# EAGLE board Full (EAGLE 9.6.2), part 1 of 3
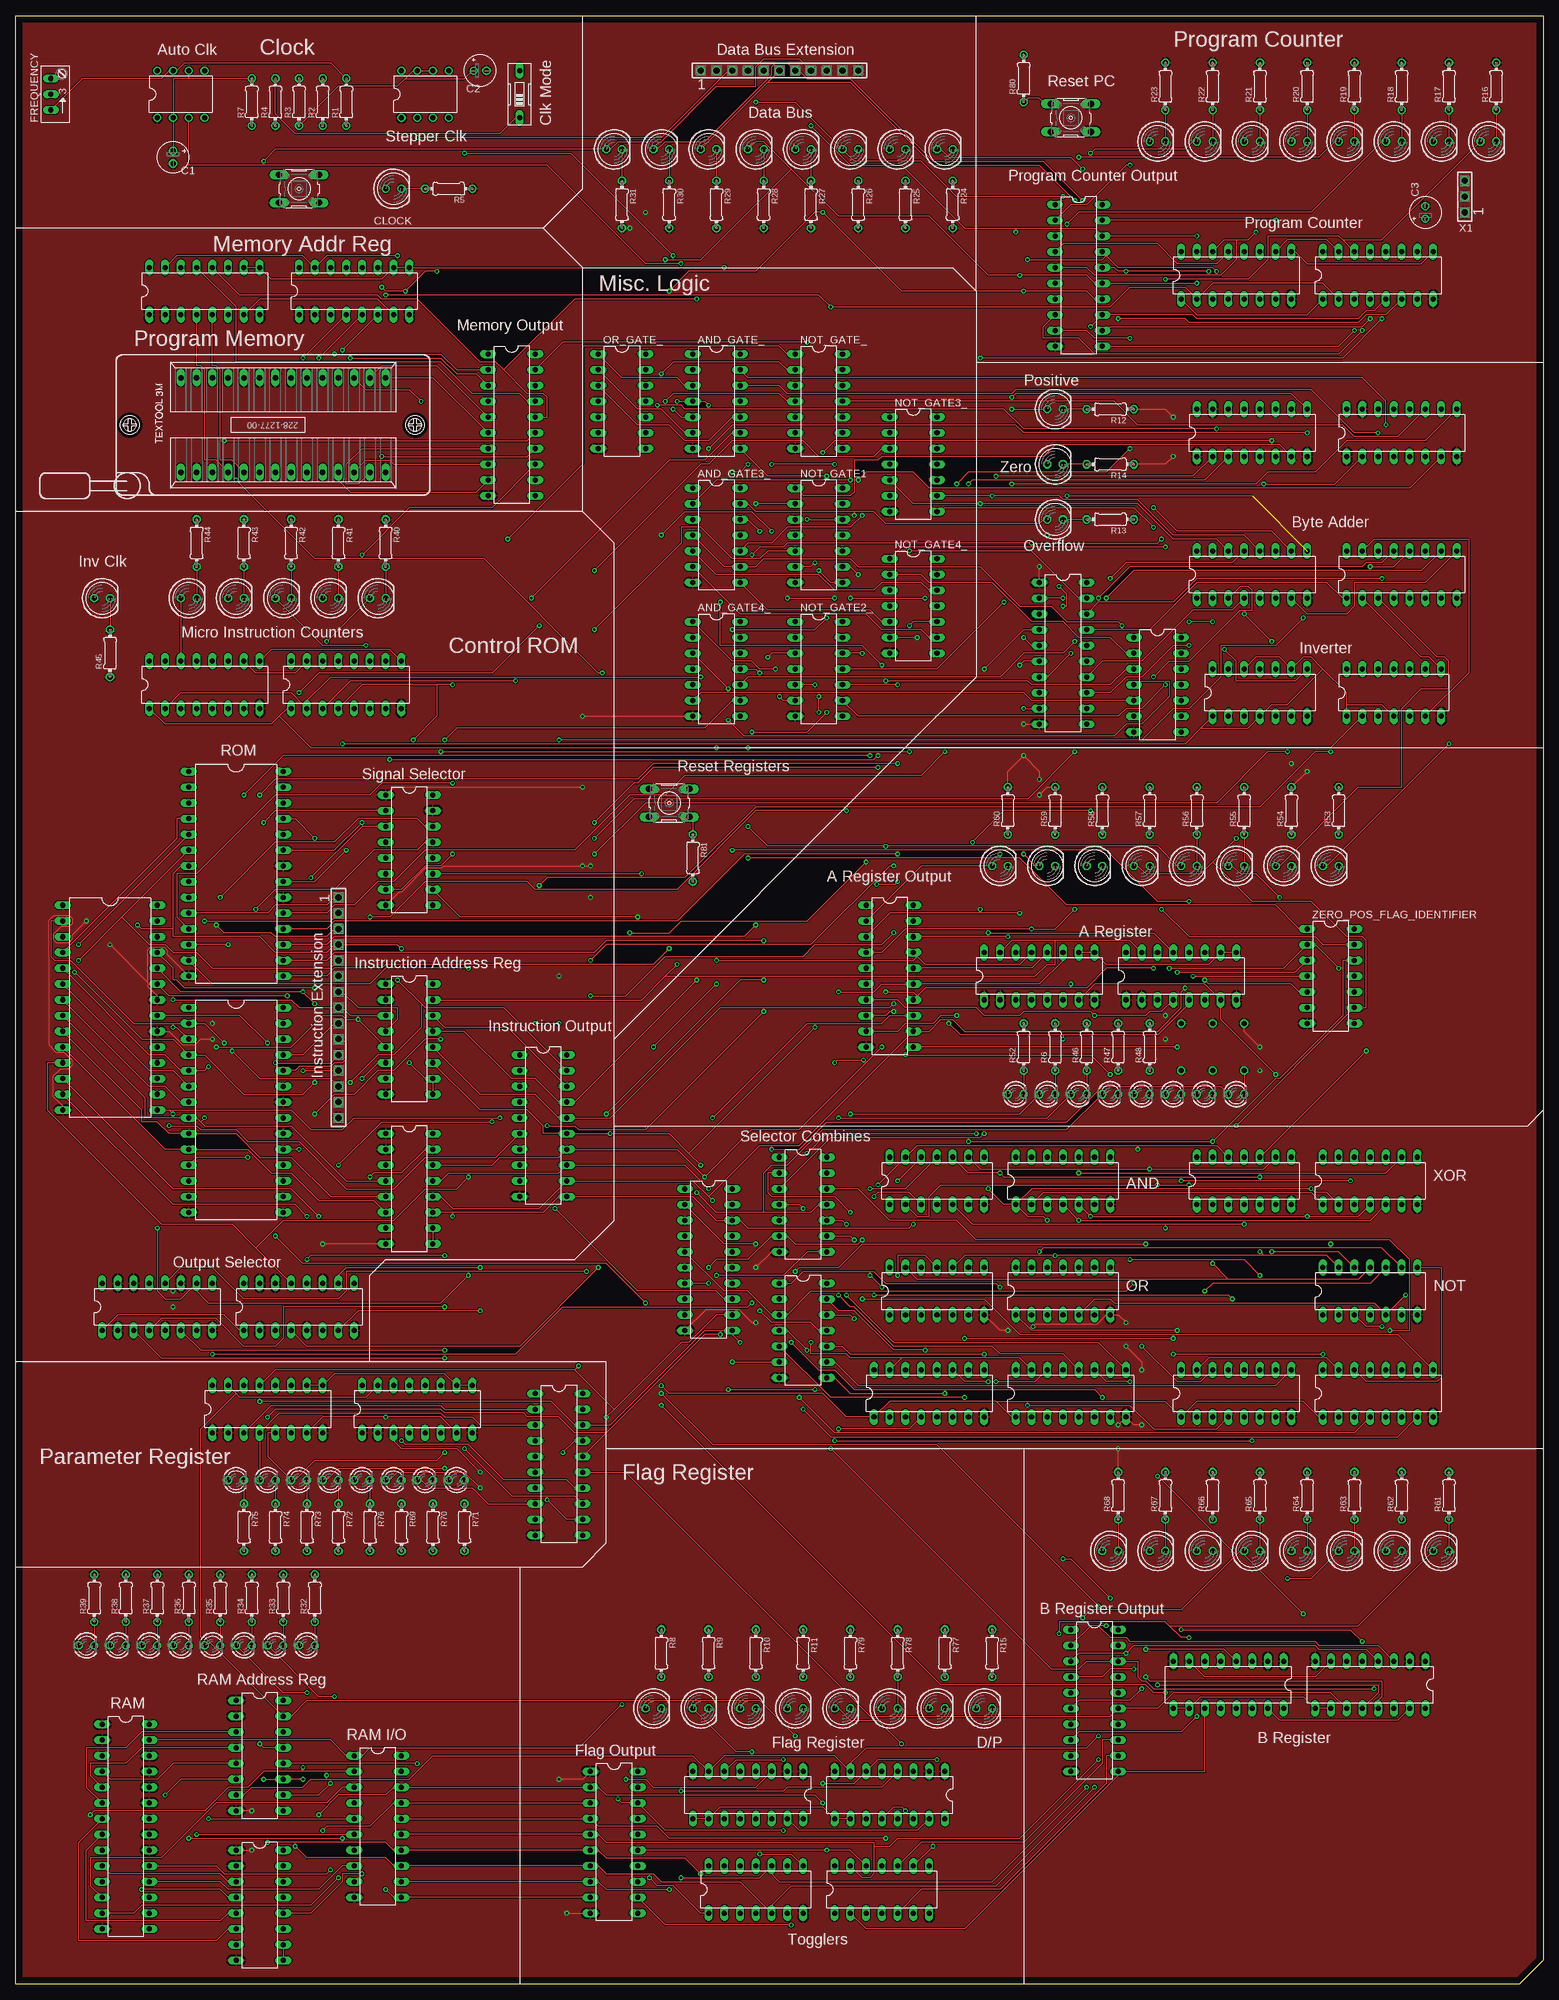
[diagram p5: board, top side]
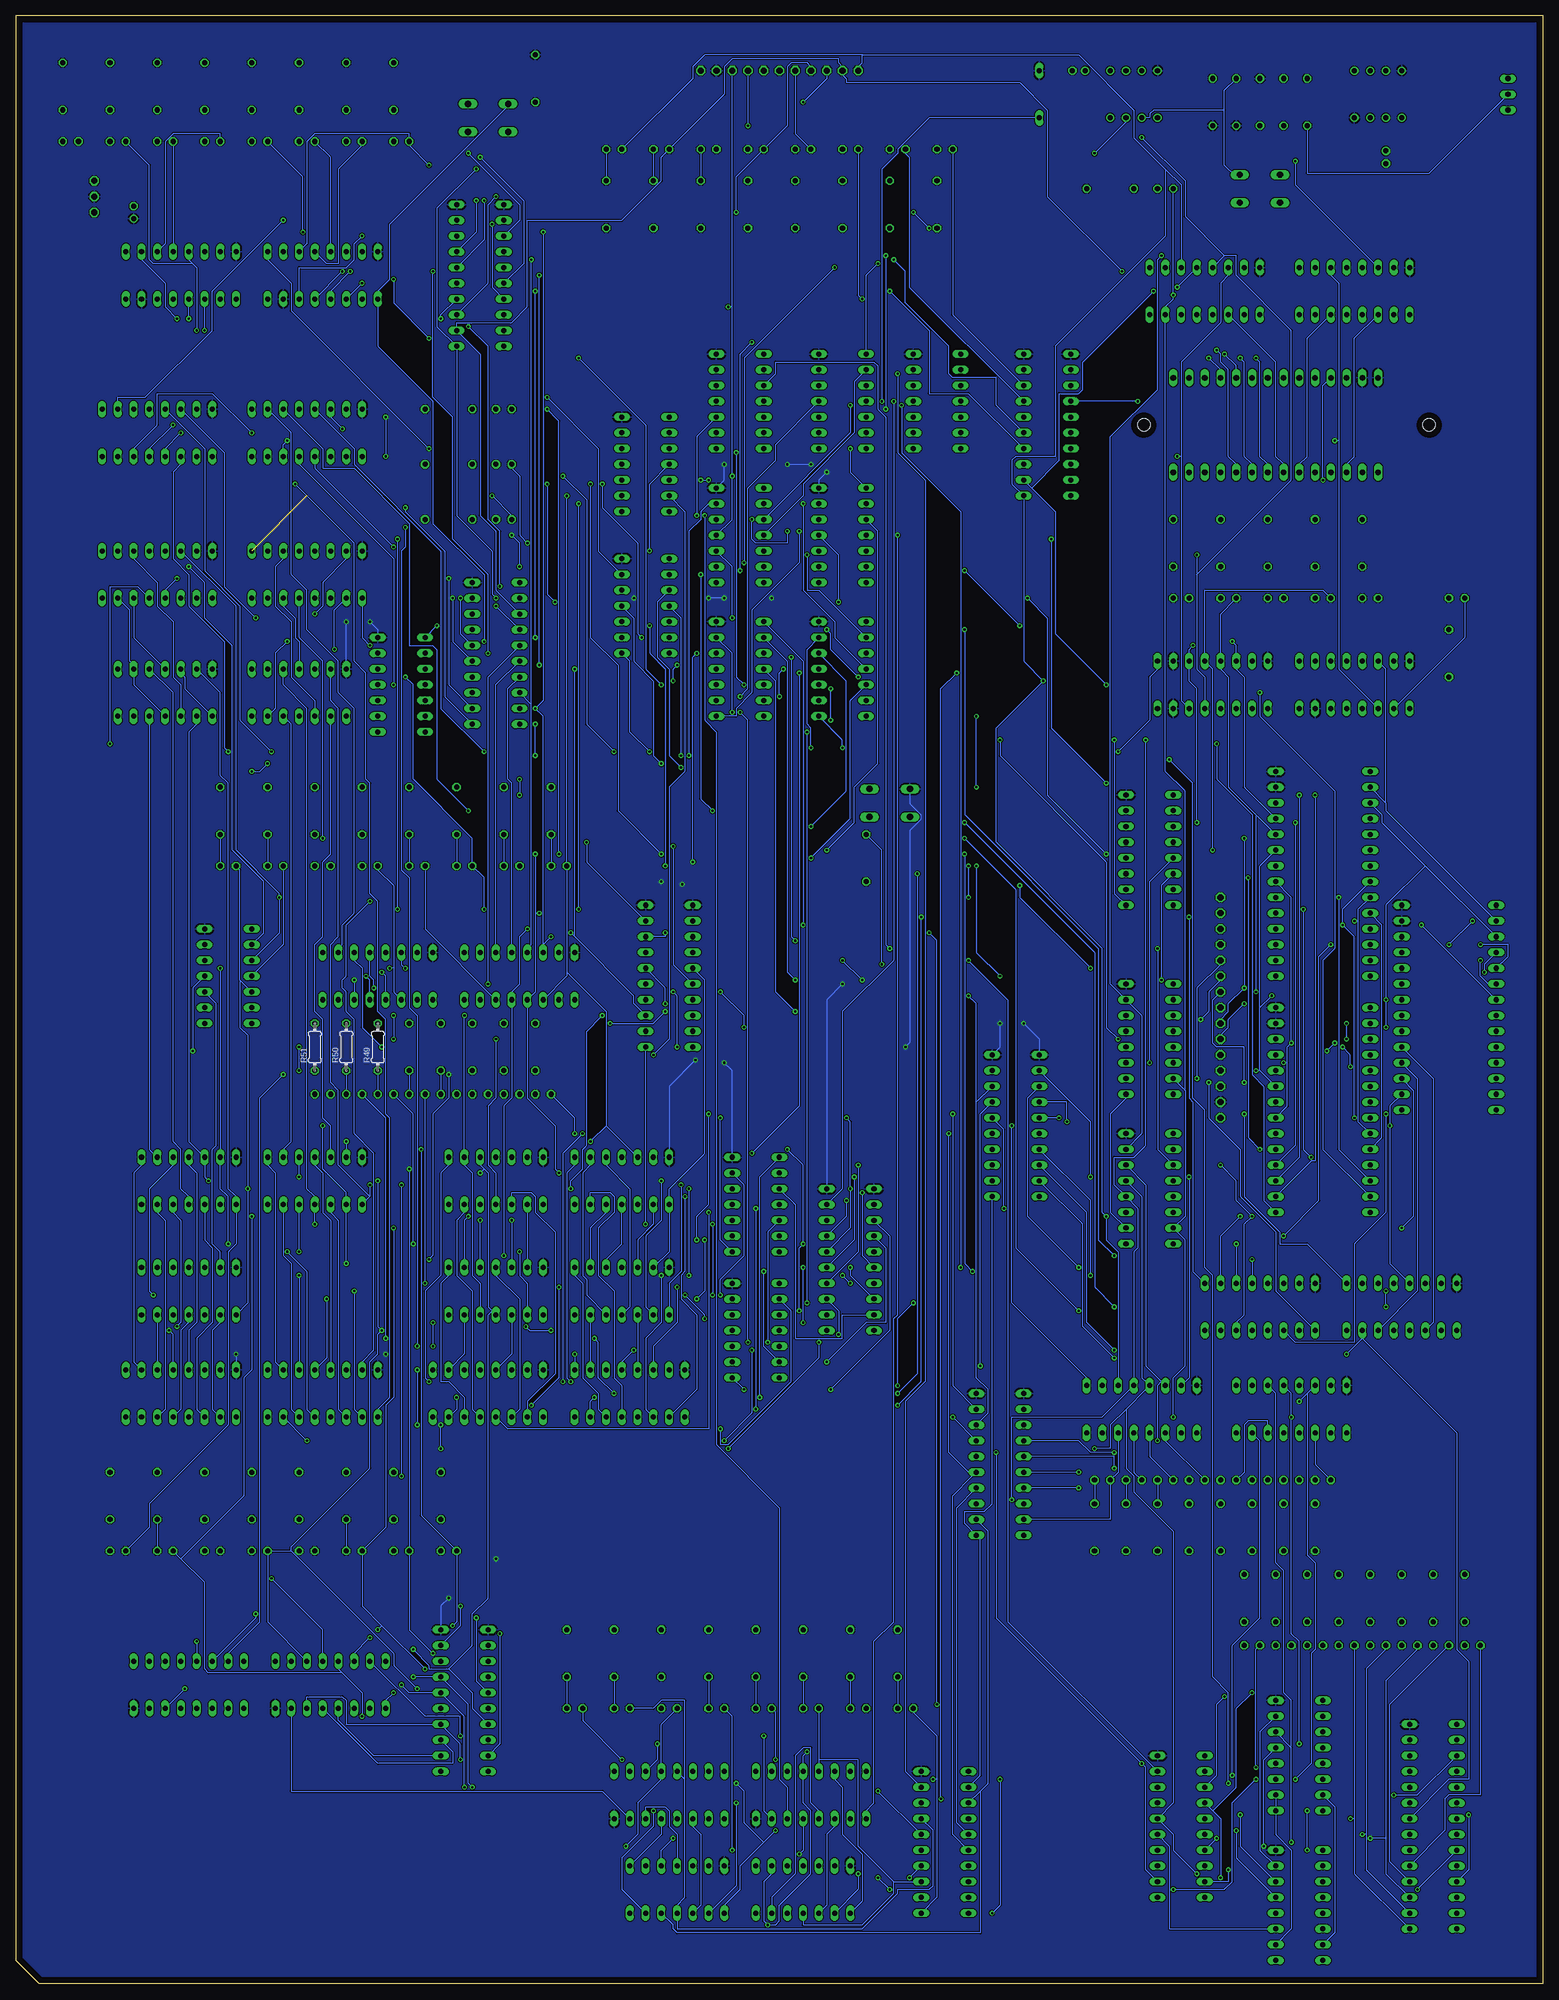
[diagram p6: board, bottom side, seen from below]

Size 246.38 x 317.5 mm. Coordinates in mm from the lower left corner, seen from the top.
Outline: 0,0 0,317.5 246.38,317.5 246.38,3.81 242.57,0 0,0
Copper layers (1*16): Top 0.035mm / dielectric 1.5mm / Bottom 0.035mm
Design rules "default": minimum track width 6mil, minimum drill 0.35mm, track to track 6mil, track to pad 6mil, pad to pad 6mil, via to via 6mil, smd to smd 6mil, copper to edge 40mil, drill to drill 6mil, minimum pad ring 10mil, minimum via ring 8mil, stop-mask expansion 4mil, vias tented up to drill 0mil, thermal gap 10mil

## Footprints (pad centres in the part's own frame; a part is rotated, then mirrored left to right if it is on the bottom)
DIL14 = drill 0.813 long: 1 -7.62,-3.81; 2 -5.08,-3.81; 3 -2.54,-3.81; 4 0,-3.81; 5 2.54,-3.81; 6 5.08,-3.81; 7 7.62,-3.81; 8 7.62,3.81; 9 5.08,3.81; 10 2.54,3.81; 11 0,3.81; 12 -2.54,3.81; 13 -5.08,3.81; 14 -7.62,3.81
DIL16 = drill 0.813 long: 1 -8.89,-3.81; 2 -6.35,-3.81; 3 -3.81,-3.81; 4 -1.27,-3.81; 5 1.27,-3.81; 6 3.81,-3.81; 7 6.35,-3.81; 8 8.89,-3.81; 9 8.89,3.81; 10 6.35,3.81; 11 3.81,3.81; 12 1.27,3.81; 13 -1.27,3.81; 14 -3.81,3.81; 15 -6.35,3.81; 16 -8.89,3.81
DIL08 = drill 0.813 pad 1.27: 1 -3.81,-3.81; 2 -1.27,-3.81; 3 1.27,-3.81; 4 3.81,-3.81; 5 3.81,3.81; 6 1.27,3.81; 7 -1.27,3.81; 8 -3.81,3.81
E2-5 = drill 0.813 pad 1.27: + -1.016,0 | drill 0.813 pad 1.27 octagon: - 1.016,0
EDG-01 = drill 0.813 long: 1 0,-3.81; 2 0,3.81
B3F-10XX = drill 1.016 long: 1 -3.251,2.261; 2 3.251,2.261; 3 -3.251,-2.261; 4 3.251,-2.261
LED5MM = drill 0.813 octagon: A -1.27,0; K 1.27,0
SSW-111-02-G-S = drill 1 pad 1.5 octagon: 1 -12.7,0; 2 -10.16,0; 3 -7.62,0; 4 -5.08,0; 5 -2.54,0; 6 0,0; 7 2.54,0; 8 5.08,0; 9 7.62,0; 10 10.16,0; 11 12.7,0
RJ9W = drill 0.813 long: A 2.54,0.635; E -2.54,0.635; S 0,0.635
DIL28-6 = drill 0.813 long: 1 -16.51,-7.62; 2 -13.97,-7.62; 3 -11.43,-7.62; 4 -8.89,-7.62; 5 -6.35,-7.62; 6 -3.81,-7.62; 7 -1.27,-7.62; 8 1.27,-7.62; 9 3.81,-7.62; 10 6.35,-7.62; 11 8.89,-7.62; 12 11.43,-7.62; 13 13.97,-7.62; 14 16.51,-7.62; 15 16.51,7.62; 16 13.97,7.62; 17 11.43,7.62; 18 8.89,7.62; 19 6.35,7.62; 20 3.81,7.62; 21 1.27,7.62; 22 -1.27,7.62; 23 -3.81,7.62; 24 -6.35,7.62; 25 -8.89,7.62; 26 -11.43,7.62; 27 -13.97,7.62; 28 -16.51,7.62
SSW-115-02-G-S = drill 1 pad 1.5 octagon: 1 -17.78,0; 2 -15.24,0; 3 -12.7,0; 4 -10.16,0; 5 -7.62,0; 6 -5.08,0; 7 -2.54,0; 8 0,0; 9 2.54,0; 10 5.08,0; 11 7.62,0; 12 10.16,0; 13 12.7,0; 14 15.24,0; 15 17.78,0
LED3MM = drill 0.813 octagon: A -1.27,0; K 1.27,0
228-1277-00-0602J = drill 0.9 long: 1 -16.51,-7.62; 2 -13.97,-7.62; 3 -11.43,-7.62; 4 -8.89,-7.62; 5 -6.35,-7.62; 6 -3.81,-7.62; 7 -1.27,-7.62; 8 1.27,-7.62; 9 3.81,-7.62; 10 6.35,-7.62; 11 8.89,-7.62; 12 11.43,-7.62; 13 13.97,-7.62; 14 16.51,-7.62; 15 16.51,7.62; 16 13.97,7.62; 17 11.43,7.62; 18 8.89,7.62; 19 6.35,7.62; 20 3.81,7.62; 21 1.27,7.62; 22 -1.27,7.62; 23 -3.81,7.62; 24 -6.35,7.62; 25 -8.89,7.62; 26 -11.43,7.62; 27 -13.97,7.62; 28 -16.51,7.62 | hole 2: 21.24,0; -24.74,0
DIL20 = drill 0.813 long: 1 -11.43,-3.81; 2 -8.89,-3.81; 3 -6.35,-3.81; 4 -3.81,-3.81; 5 -1.27,-3.81; 6 1.27,-3.81; 7 3.81,-3.81; 8 6.35,-3.81; 9 8.89,-3.81; 10 11.43,-3.81; 11 11.43,3.81; 12 8.89,3.81; 13 6.35,3.81; 14 3.81,3.81; 15 1.27,3.81; 16 -1.27,3.81; 17 -3.81,3.81; 18 -6.35,3.81; 19 -8.89,3.81; 20 -11.43,3.81
0204/7 = drill 0.813 octagon: 1 -3.81,0; 2 3.81,0
DIL28-3 = drill 0.813 long: 1 -16.51,-3.81; 2 -13.97,-3.81; 3 -11.43,-3.81; 4 -8.89,-3.81; 5 -6.35,-3.81; 6 -3.81,-3.81; 7 -1.27,-3.81; 8 1.27,-3.81; 9 3.81,-3.81; 10 6.35,-3.81; 11 8.89,-3.81; 12 11.43,-3.81; 13 13.97,-3.81; 14 16.51,-3.81; 15 16.51,3.81; 16 13.97,3.81; 17 11.43,3.81; 18 8.89,3.81; 19 6.35,3.81; 20 3.81,3.81; 21 1.27,3.81; 22 -1.27,3.81; 23 -3.81,3.81; 24 -6.35,3.81; 25 -8.89,3.81; 26 -11.43,3.81; 27 -13.97,3.81; 28 -16.51,3.81
SSW-103-02-G-S = drill 1 pad 1.5 octagon: 1 -2.54,0; 2 0,0; 3 2.54,0

## Placement (x,y rotation side)
4_INP_OR_GATE  4072N  [DIL14]  184.15,209.55 270 top
ADDER_LOWER  74LS283N  [DIL16]  223.52,227.33 0 top
ADDER_UPPER  74LS283N  [DIL16]  199.39,227.33 0 top
ADDR_MEM_REG_LOWER  74LS173N  [DIL16]  54.61,273.05 0 top
ADDR_MEM_REG_UPPER  74LS173N  [DIL16]  30.48,273.05 0 top
ADDR_REG_A_LOWER  74LS173N  [DIL16]  187.96,162.56 0 top
ADDR_REG_A_UPPER  74LS173N  [DIL16]  165.1,162.56 0 top
ADDR_REG_CALC_LOWER  74LS173N  [DIL16]  195.58,48.26 180 top
ADDR_REG_CALC_UPPER  74LS173N  [DIL16]  218.44,48.26 180 top
ADDR_REG_PARAM_LOWER  74LS173N  [DIL16]  64.77,92.71 0 top
ADDR_REG_PARAM_UPPER  74LS173N  [DIL16]  40.64,92.71 0 top
AND_GATE1_  74LS08N  [DIL14]  168.91,129.54 0 top
AND_GATE2_  74LS08N  [DIL14]  148.59,129.54 0 top
AND_GATE3_  74LS08N  [DIL14]  113.03,233.68 270 top
AND_GATE4_  74LS08N  [DIL14]  113.03,212.09 270 top
AND_GATE_  74LS08N  [DIL14]  113.03,255.27 270 top
AUTO_CLOCK  NE555N  [DIL08]  26.67,304.8 0 top
BRANCH_SELECTOR  74HC139N  [DIL16]  199.39,250.19 0 top
C1  4.7uF  [E2-5]  25.4,294.64 270 top
C2  0.1uF  [E2-5]  74.93,308.61 0 top
C3  0.1uF  [E2-5]  227.33,285.75 90 top
CLK_MODE  [EDG-01]  81.28,304.8 0 top
CLK_TRIGGER  [B3F-10XX]  45.72,289.56 0 top
CLOCK  Yellow  [LED5MM]  60.96,289.56 0 top
DATABUS_1  LED  [LED5MM]  149.86,295.91 0 top
DATABUS_2  [LED5MM]  142.24,295.91 0 top
DATABUS_3  [LED5MM]  134.62,295.91 0 top
DATABUS_4  [LED5MM]  127,295.91 0 top
DATABUS_5  [LED5MM]  119.38,295.91 0 top
DATABUS_6  [LED5MM]  111.76,295.91 0 top
DATABUS_7  [LED5MM]  104.14,295.91 0 top
DATABUS_8  [LED5MM]  96.52,295.91 0 top
EXTENSION  SSW-111-02-G-S  [SSW-111-02-G-S]  123.19,308.61 0 top
FLAG_1  [LED5MM]  156.21,44.45 0 top
FLAG_2  [LED5MM]  148.59,44.45 0 top
FLAG_3  [LED5MM]  140.97,44.45 0 top
FLAG_4  [LED5MM]  133.35,44.45 0 top
FLAG_5  [LED5MM]  125.73,44.45 0 top
FLAG_6  [LED5MM]  118.11,44.45 0 top
FLAG_7  [LED5MM]  110.49,44.45 0 top
FLAG_8  [LED5MM]  102.87,44.45 0 top
FLAG_REG_LOWER  74LS173N  [DIL16]  118.11,30.48 180 top
FLAG_REG_UPPER  74LS173N  [DIL16]  140.97,30.48 180 top
FREQUENCY  100k  [RJ9W]  6.35,304.8 90 top
INSRUCTION_REGISTER_SELECTOR_LOWER  74LS157N  [DIL16]  45.72,109.22 0 top
INSRUCTION_REGISTER_SELECTOR_UPPER  74LS157N  [DIL16]  22.86,109.22 0 top
INSTRUC_REGISTER_LOWER  74LS173N  [DIL16]  63.5,128.27 270 top
INSTRUC_REGISTER_UPPER  74LS173N  [DIL16]  63.5,152.4 270 top
INSTRUCTION_MEMORY_0  AT28C64B  [DIL28-6]  15.24,157.48 270 top
INSTRUCTION_MEMORY_1  AT28C64B  [DIL28-6]  35.56,140.97 270 top
INSTRUCTION_MEMORY_2  AT28C64B  [DIL28-6]  35.56,179.07 270 top
INSTRUCTIONS_EXTENSION  SSW-115-02-G-S  [SSW-115-02-G-S]  52.07,157.48 270 top
INVERTED_CLK_LED  White  [LED5MM]  13.97,223.52 0 top
LED_A_REG_1  [LED5MM]  212.09,180.34 0 top
LED_A_REG_2  [LED5MM]  204.47,180.34 0 top
LED_A_REG_3  [LED5MM]  196.85,180.34 0 top
LED_A_REG_4  [LED5MM]  189.23,180.34 0 top
LED_A_REG_5  [LED5MM]  181.61,180.34 0 top
LED_A_REG_6  [LED5MM]  173.99,180.34 0 top
LED_A_REG_7  [LED5MM]  166.37,180.34 0 top
LED_A_REG_8  [LED5MM]  158.75,180.34 0 top
LED_B_REG_1  [LED5MM]  229.87,69.85 0 top
LED_B_REG_2  [LED5MM]  222.25,69.85 0 top
LED_B_REG_3  [LED5MM]  214.63,69.85 0 top
LED_B_REG_4  [LED5MM]  207.01,69.85 0 top
LED_B_REG_5  [LED5MM]  199.39,69.85 0 top
LED_B_REG_6  [LED5MM]  191.77,69.85 0 top
LED_B_REG_7  [LED5MM]  184.15,69.85 0 top
LED_B_REG_8  [LED5MM]  176.53,69.85 0 top
LOGIC_LED_1  [LED3MM]  196.85,143.51 0 top
LOGIC_LED_2  [LED3MM]  191.77,143.51 0 top
LOGIC_LED_3  [LED3MM]  186.69,143.51 0 top
LOGIC_LED_4  [LED3MM]  181.61,143.51 0 top
LOGIC_LED_5  [LED3MM]  176.53,143.51 0 top
LOGIC_LED_6  [LED3MM]  171.45,143.51 0 top
LOGIC_LED_7  [LED3MM]  166.37,143.51 0 top
LOGIC_LED_8  [LED3MM]  161.29,143.51 0 top
LOGIC_SELECTOR-AND/OR_LOWER  74LS157N  [DIL16]  170.18,95.25 0 top
LOGIC_SELECTOR-AND/OR_UPPER  74LS157N  [DIL16]  147.32,95.25 0 top
LOGIC_SELECTOR-XOR/NOT_LOWER  74LS157N  [DIL16]  219.71,95.25 0 top
LOGIC_SELECTOR-XOR/NOT_UPPER  74LS157N  [DIL16]  196.85,95.25 0 top
MEMORY  228-1277-00-0602J  [228-1277-00-0602J]  43.18,251.46 0 top
MICRO_COUNTER_LOWER  74LS161  [DIL16]  53.34,209.55 0 top
MICRO_COUNTER_UPPER  74LS161  [DIL16]  30.48,209.55 0 top
NOT_GATE1  74LS04N  [DIL14]  129.54,233.68 270 top
NOT_GATE2_  74LS04N  [DIL14]  129.54,212.09 270 top
NOT_GATE3_  74LS04N  [DIL14]  144.78,245.11 270 top
NOT_GATE4_  74LS04N  [DIL14]  144.78,222.25 270 top
NOT_GATE5_  74LS04N  [DIL14]  218.44,111.76 0 top
NOT_GATE_  74LS04N  [DIL14]  129.54,255.27 270 top
OR_GATE1_  74LS32N  [DIL14]  148.59,111.76 0 top
OR_GATE2_  74LS32N  [DIL14]  168.91,111.76 0 top
OR_GATE3_  74LS32N  [DIL14]  127,125.73 270 top
OR_GATE4_  74LS32N  [DIL14]  127,105.41 270 top
OR_GATE_  74LS32N  [DIL14]  97.79,255.27 270 top
OUTPUT_BUFFER_ALU  74LS245N  [DIL20]  168.91,214.63 270 top
OUTPUT_BUFFER_CALC_REG  74LS245N  [DIL20]  173.99,45.72 270 top
OUTPUT_BUFFER_FLAGS  74HC245N  [DIL20]  96.52,22.86 270 top
OUTPUT_BUFFER_INSTRUCTION  74LS245N  [DIL20]  85.09,138.43 270 top
OUTPUT_BUFFER_LOGIC  74LS245N  [DIL20]  111.76,116.84 270 top
OUTPUT_BUFFER_MEMORY  74LS245N  [DIL20]  80.01,251.46 270 top
OUTPUT_BUFFER_PARAM_REG  74LS245N  [DIL20]  87.63,83.82 270 top
OUTPUT_BUFFER_PC  74LS245N  [DIL20]  171.45,275.59 270 top
OUTPUT_BUFFER_RAM  74HC245N  [DIL20]  58.42,25.4 270 top
OUTPUT_BUFFER_REG_A  74LS245N  [DIL20]  140.97,162.56 270 top
OVERFLOW_FLAG  [LED5MM]  167.64,236.22 0 top
PARAM_LED_1  [LED3MM]  71.12,81.28 0 top
PARAM_LED_2  [LED3MM]  66.04,81.28 0 top
PARAM_LED_3  [LED3MM]  60.96,81.28 0 top
PARAM_LED_4  [LED3MM]  55.88,81.28 0 top
PARAM_LED_5  [LED3MM]  50.8,81.28 0 top
PARAM_LED_6  [LED3MM]  45.72,81.28 0 top
PARAM_LED_7  [LED3MM]  40.64,81.28 0 top
PARAM_LED_8  [LED3MM]  35.56,81.28 0 top
PC_1  [LED5MM]  237.49,297.18 0 top
PC_2  [LED5MM]  229.87,297.18 0 top
PC_3  [LED5MM]  222.25,297.18 0 top
PC_4  [LED5MM]  214.63,297.18 0 top
PC_5  [LED5MM]  207.01,297.18 0 top
PC_6  [LED5MM]  199.39,297.18 0 top
PC_7  [LED5MM]  191.77,297.18 0 top
PC_8  [LED5MM]  184.15,297.18 0 top
POSITIVE_FLAG  [LED5MM]  167.64,254 0 top
PROGRAM_COUNTER_LOWER  74LS161  [DIL16]  219.71,275.59 0 top
PROGRAM_COUNTER_UPPER  74LS161  [DIL16]  196.85,275.59 0 top
R1  1k  [0204/7]  53.34,303.53 90 top
R2  1k  [0204/7]  49.53,303.53 90 top
R3  10k  [0204/7]  45.72,303.53 90 top
R4  220  [0204/7]  41.91,303.53 90 top
R5  ~220  [0204/7]  69.85,289.56 180 top
R6  ~220  [0204/7]  167.64,151.13 90 top
R7  220  [0204/7]  38.1,303.53 90 top
R8  ~220  [0204/7]  104.14,53.34 270 top
R9  ~220  [0204/7]  111.76,53.34 270 top
R10  ~220  [0204/7]  119.38,53.34 270 top
R11  ~220  [0204/7]  127,53.34 270 top
R12  ~220  [0204/7]  176.53,254 180 top
R13  ~220  [0204/7]  176.53,236.22 180 top
R14  ~220  [0204/7]  176.53,245.11 180 top
R15  ~220  [0204/7]  157.48,53.34 270 top
R16  ~220  [0204/7]  238.76,306.07 90 top
R17  ~220  [0204/7]  231.14,306.07 90 top
R18  ~220  [0204/7]  223.52,306.07 90 top
R19  ~220  [0204/7]  215.9,306.07 90 top
R20  ~220  [0204/7]  208.28,306.07 90 top
R21  ~220  [0204/7]  200.66,306.07 90 top
R22  ~220  [0204/7]  193.04,306.07 90 top
R23  ~220  [0204/7]  185.42,306.07 90 top
R24  ~220  [0204/7]  151.13,287.02 270 top
R25  ~220  [0204/7]  143.51,287.02 270 top
R26  ~220  [0204/7]  135.89,287.02 270 top
R27  ~220  [0204/7]  128.27,287.02 270 top
R28  ~220  [0204/7]  120.65,287.02 270 top
R29  ~220  [0204/7]  113.03,287.02 270 top
R30  ~220  [0204/7]  105.41,287.02 270 top
R31  ~220  [0204/7]  97.79,287.02 270 top
R32  ~220  [0204/7]  48.26,62.23 90 top
R33  ~220  [0204/7]  43.18,62.23 90 top
R34  ~220  [0204/7]  38.1,62.23 90 top
R35  ~220  [0204/7]  33.02,62.23 90 top
R36  ~220  [0204/7]  27.94,62.23 90 top
R37  ~220  [0204/7]  22.86,62.23 90 top
R38  ~220  [0204/7]  17.78,62.23 90 top
R39  ~220  [0204/7]  12.7,62.23 90 top
R40  ~220  [0204/7]  59.69,232.41 270 top
R41  ~220  [0204/7]  52.07,232.41 270 top
R42  ~220  [0204/7]  44.45,232.41 270 top
R43  ~220  [0204/7]  36.83,232.41 270 top
R44  ~220  [0204/7]  29.21,232.41 270 top
R45  ~220  [0204/7]  15.24,214.63 90 top
R46  ~220  [0204/7]  172.72,151.13 90 top
R47  ~220  [0204/7]  177.8,151.13 90 top
R48  ~220  [0204/7]  182.88,151.13 90 top
R49  ~220  [0204/7]  187.96,151.13 90 bottom
R50  ~220  [0204/7]  193.04,151.13 90 bottom
R51  ~220  [0204/7]  198.12,151.13 90 bottom
R52  ~220  [0204/7]  162.56,151.13 90 top
R53  ~220  [0204/7]  213.36,189.23 90 top
R54  ~220  [0204/7]  205.74,189.23 90 top
R55  ~220  [0204/7]  198.12,189.23 90 top
R56  ~220  [0204/7]  190.5,189.23 90 top
R57  ~220  [0204/7]  182.88,189.23 90 top
R58  ~220  [0204/7]  175.26,189.23 90 top
R59  ~220  [0204/7]  167.64,189.23 90 top
R60  ~220  [0204/7]  160.02,189.23 90 top
R61  ~220  [0204/7]  231.14,78.74 90 top
R62  ~220  [0204/7]  223.52,78.74 90 top
R63  ~220  [0204/7]  215.9,78.74 90 top
R64  ~220  [0204/7]  208.28,78.74 90 top
R65  ~220  [0204/7]  200.66,78.74 90 top
R66  ~220  [0204/7]  193.04,78.74 90 top
R67  ~220  [0204/7]  185.42,78.74 90 top
R68  ~220  [0204/7]  177.8,78.74 90 top
R69  ~220  [0204/7]  62.23,73.66 270 top
R70  ~220  [0204/7]  67.31,73.66 270 top
R71  ~220  [0204/7]  72.39,73.66 270 top
R72  ~220  [0204/7]  52.07,73.66 270 top
R73  ~220  [0204/7]  46.99,73.66 270 top
R74  ~220  [0204/7]  41.91,73.66 270 top
R75  ~220  [0204/7]  36.83,73.66 270 top
R76  ~220  [0204/7]  57.15,73.66 270 top
R77  ~220  [0204/7]  149.86,53.34 270 top
R78  ~220  [0204/7]  142.24,53.34 270 top
R79  ~220  [0204/7]  134.62,53.34 270 top
R80  ~220  [0204/7]  162.56,307.34 90 top
R81  ~220  [0204/7]  109.22,181.61 270 top
RAM  71256SA15TPG  [DIL28-3]  17.78,25.4 270 top
RAM_ADDR_LOWER  74LS173N  [DIL16]  39.37,12.7 270 top
RAM_ADDR_UPPER  74LS173N  [DIL16]  39.37,36.83 270 top
RAM_LED_1  [LED3MM]  46.99,54.61 0 top
RAM_LED_2  [LED3MM]  41.91,54.61 0 top
RAM_LED_3  [LED3MM]  36.83,54.61 0 top
RAM_LED_4  [LED3MM]  31.75,54.61 0 top
RAM_LED_5  [LED3MM]  26.67,54.61 0 top
RAM_LED_6  [LED3MM]  21.59,54.61 0 top
RAM_LED_7  [LED3MM]  16.51,54.61 0 top
RAM_LED_8  [LED3MM]  11.43,54.61 0 top
RESET_PC  NORM-OFF  [B3F-10XX]  170.18,300.99 0 top
RESET_REGS  NORM-OFF  [B3F-10XX]  105.41,190.5 0 top
SELECTOR_LOGIC2_  74HC139N  [DIL16]  63.5,182.88 270 top
SELECTOR_LOGIC_  74HC139N  [DIL16]  223.52,250.19 0 top
STEPPER_CLOCK  NE555N  [DIL08]  66.04,304.8 0 top
SUBTRACT_INVRTR_LOWER_  74LS86N  [DIL14]  222.25,208.28 0 top
SUBTRACT_INVRTR_UPPER_  74LS86N  [DIL14]  200.66,208.28 0 top
USTEP_1  [LED5MM]  58.42,223.52 0 top
USTEP_2  [LED5MM]  50.8,223.52 0 top
USTEP_3  [LED5MM]  43.18,223.52 0 top
USTEP_4  [LED5MM]  35.56,223.52 0 top
USTEP_5  [LED5MM]  27.94,223.52 0 top
X1  SSW-103-02-G-S  [SSW-103-02-G-S]  233.68,288.29 90 top
XOR_GATE_1  74LS86N  [DIL14]  139.7,15.24 0 top
XOR_GATE_2  74LS86N  [DIL14]  119.38,15.24 0 top
XOR_LOGIC_LOWER  74LS86N  [DIL14]  218.44,129.54 0 top
XOR_LOGIC_UPPER  74LS86N  [DIL14]  198.12,129.54 0 top
ZERO_FLAG  [LED5MM]  167.64,245.11 0 top
ZERO_POS_FLAG_IDENTIFIER  744078N  [DIL14]  212.09,162.56 270 top

## Tracks (layer width: path | path; a pad name or v marks a point on that pad's centre or on a via)
1_PLACE  (via drill 0.35)
  Top 0.152: v168.91,223.52 OUTPUT_BUFFER_ALU.2 | v215.9,266.7 213.36,264.16 OUTPUT_BUFFER_PC.11 | MICRO_COUNTER_LOWER.3 53.98,210.19 v80.64,210.19 | v172.09,292.74 170.18,294.64 150.5,294.64 149.22,295.91 DATABUS_1.A | v187.32,151.13 OUTPUT_BUFFER_REG_A.11 | 70.48,124.46 85.09,124.46 87.63,127 OUTPUT_BUFFER_INSTRUCTION.11 109.22,127 113.03,123.19 OUTPUT_BUFFER_LOGIC.18 116.84,123.19 118.11,121.92 144.15,121.92 v144.78,122.56 | 70.48,124.46 INSTRUC_REGISTER_LOWER.11 | 70.48,124.46 v70.48,123.83 | XOR_GATE_1.2 137.16,8.89 153.03,8.89 177.8,33.66 OUTPUT_BUFFER_CALC_REG.11 191.77,34.29 ADDR_REG_CALC_LOWER.11 | v48.9,27.3 52.07,30.48 59.69,30.48 60.96,31.75 OUTPUT_BUFFER_RAM.18 OUTPUT_BUFFER_FLAGS.2 93.98,31.75 95.25,30.48 128.91,30.48 v130.18,29.21
  Bottom 0.152: v168.91,223.52 169.54,224.16 169.54,231.14 175.26,236.85 OUTPUT_BUFFER_PC.11 178.44,267.33 178.44,286.38 v172.09,292.74 | v215.9,266.7 PROGRAM_COUNTER_LOWER.3 | ADDR_MEM_REG_LOWER.11 58.42,290.19 60.96,292.74 | 60.96,292.74 66.04,297.81 66.04,302.26 74.93,311.15 109.86,311.15 | 109.86,311.15 109.86,309.88 110.49,309.25 EXTENSION.1 | DATABUS_1.A 137.16,307.34 137.16,309.25 135.25,311.15 109.86,311.15 | 60.96,292.74 60.96,281.94 78.74,264.16 78.74,246.38 85.09,246.38 85.72,245.75 85.72,241.94 OUTPUT_BUFFER_MEMORY.11 83.82,213.36 v80.64,210.19 88.27,202.56 88.27,184.15 71.12,167 71.12,124.46 v70.48,123.83 70.48,120.02 68.58,118.11 ADDR_REG_PARAM_LOWER.11 | v187.32,151.13 190.5,154.31 190.5,163.83 191.77,165.1 ADDR_REG_A_LOWER.11 | v144.78,122.56 OUTPUT_BUFFER_REG_A.11 | RAM_ADDR_LOWER.14 48.9,22.23 v48.9,27.3 | OUTPUT_BUFFER_FLAGS.2 90.81,33.66 90.81,71.75 OUTPUT_BUFFER_PARAM_REG.11 93.34,74.3 93.34,76.2 90.17,76.2 88.9,77.47 OUTPUT_BUFFER_INSTRUCTION.11 | XOR_GATE_1.2 130.18,15.88 v130.18,29.21
2_PLACE  (via drill 0.35)
  Top 0.152: MICRO_COUNTER_LOWER.4 55.88,209.55 63.5,209.55 64.14,209.55 67.94,209.55 | v70.48,209.55 67.94,209.55 | v59.05,273.69 59.69,273.05 v62.87,273.05 66.04,276.23 v67.94,276.23 | v218.44,268.61 217.17,267.33 176.53,267.33 175.9,266.7 OUTPUT_BUFFER_PC.12 | INSTRUC_REGISTER_LOWER.12 68.58,127 70.48,125.09 84.45,125.09 OUTPUT_BUFFER_INSTRUCTION.12 109.22,129.54 111.76,127 | 111.76,127 v112.39,126.36 | 111.76,127 120.02,135.25 126.36,135.25 OUTPUT_BUFFER_REG_A.12 147.32,153.67 149.22,155.57 151.13,155.57 153.03,153.67 184.15,153.67 187.96,157.48 187.96,160.02 v188.59,160.66 | XOR_GATE_1.5 146.05,15.24 158.75,15.24 175.9,32.38 175.9,36.83 OUTPUT_BUFFER_CALC_REG.12 | v49.53,24.77 50.16,25.4 57.15,25.4 60.96,29.21 OUTPUT_BUFFER_RAM.17 OUTPUT_BUFFER_FLAGS.3 | v85.72,78.11 88.9,74.93 OUTPUT_BUFFER_PARAM_REG.12 | 67.94,209.55 67.94,204.47 v64.14,200.66
  Bottom 0.152: v70.48,209.55 78.74,217.81 78.74,237.49 82.55,241.3 | OUTPUT_BUFFER_MEMORY.12 82.55,241.3 | v59.05,273.69 ADDR_MEM_REG_LOWER.12 | v62.87,273.05 74.3,261.62 74.3,257.18 74.93,256.54 78.11,256.54 78.11,245.75 82.55,241.3 | OUTPUT_BUFFER_ALU.3 168.91,224.79 168.91,234.31 171.45,236.85 171.45,262.89 OUTPUT_BUFFER_PC.12 175.26,267.97 166.37,267.97 163.83,270.51 163.83,284.48 148.59,284.48 142.24,290.83 142.24,294.64 DATABUS_2.A 132.08,304.8 132.08,309.25 130.81,310.51 113.67,310.51 113.67,309.88 113.03,309.25 EXTENSION.2 113.03,307.98 112.39,307.34 112.39,306.7 84.45,306.7 80.01,302.26 80.01,288.29 v67.94,276.23 | v218.44,268.61 PROGRAM_COUNTER_LOWER.4 | OUTPUT_BUFFER_LOGIC.17 112.39,123.83 v112.39,126.36 | ADDR_REG_A_LOWER.12 189.23,162.56 188.59,161.93 v188.59,160.66 | ADDR_REG_CALC_LOWER.12 194.31,42.55 188.59,36.83 OUTPUT_BUFFER_CALC_REG.12 | RAM_ADDR_LOWER.13 49.53,20.32 v49.53,24.77 | OUTPUT_BUFFER_PARAM_REG.12 89.53,73.03 89.53,32.38 90.81,31.11 | OUTPUT_BUFFER_FLAGS.3 90.81,31.11 | XOR_GATE_1.5 140.34,9.53 140.34,8.89 139.7,8.26 90.81,8.26 90.81,31.11 | v85.72,78.11 85.72,91.44 71.12,91.44 ADDR_REG_PARAM_LOWER.12 66.04,118.11 65.41,118.75 65.41,125.09 INSTRUC_REGISTER_LOWER.12 69.22,128.91 69.22,133.35 66.04,133.35 64.14,135.25 v64.14,200.66
4_PLACE  (via drill 0.35)
  Top 0.152: v55.88,230.5 63.5,238.12 76.83,238.12 OUTPUT_BUFFER_MEMORY.13 | v119.38,303.53 125.73,303.53 DATABUS_3.A 135.25,294 146.05,294 151.76,288.29 v168.91,288.29 | PROGRAM_COUNTER_LOWER.5 219.07,269.88 217.81,269.88 216.53,268.61 190.5,268.61 189.87,269.24 OUTPUT_BUFFER_PC.13 v173.35,267.33 | v64.77,297.81 104.14,297.81 114.94,308.61 EXTENSION.3 | RAM_ADDR_LOWER.12 47.62,11.43 52.7,16.51 52.7,17.78 v55.88,17.78 | OUTPUT_BUFFER_RAM.16 OUTPUT_BUFFER_FLAGS.4 93.98,25.4 103.5,25.4 105.41,23.5 v140.34,23.5 | XOR_GATE_1.10 146.05,22.86 162.56,22.86 175.26,35.56 175.26,39.37 OUTPUT_BUFFER_CALC_REG.13 | INSTRUC_REGISTER_LOWER.13 68.58,129.54 69.85,130.81 87.63,130.81 OUTPUT_BUFFER_INSTRUCTION.13 107.95,132.08 v111.76,128.27 | OUTPUT_BUFFER_PARAM_REG.13 90.17,78.74 80.01,78.74 v72.39,86.36 | OUTPUT_BUFFER_REG_A.13 140.97,156.21 139.7,154.94 127.64,154.94 v112.39,139.7 | ADDR_REG_A_LOWER.13 183.51,169.54 v156.84,169.54 | OUTPUT_BUFFER_ALU.4 162.56,218.44 v156.21,212.09 | v168.28,225.43 169.54,224.16 169.54,222.25 v168.91,222.25
  Bottom 0.152: MICRO_COUNTER_LOWER.5 54.61,210.82 55.88,212.09 55.88,227.33 | v55.88,230.5 55.88,227.33 | 51.44,278.76 ADDR_MEM_REG_LOWER.13 | 51.44,278.76 49.53,278.76 49.53,275.59 40.64,266.7 40.64,242.57 55.88,227.33 | v119.38,303.53 115.57,307.34 EXTENSION.3 | v168.91,288.29 170.18,287.02 170.18,274.32 OUTPUT_BUFFER_PC.13 | 51.44,278.76 57.78,285.12 57.78,290.83 v64.77,297.81 | v55.88,17.78 59.69,21.59 59.69,24.13 OUTPUT_BUFFER_RAM.16 59.69,29.21 59.69,73.03 66.04,79.38 66.04,81.92 67.31,83.19 67.31,92.71 | ADDR_REG_CALC_LOWER.13 187.96,35.56 175.9,35.56 175.9,37.47 OUTPUT_BUFFER_CALC_REG.13 | v140.34,23.5 142.24,21.59 XOR_GATE_1.10 | 64.14,97.16 64.77,97.79 64.77,127 INSTRUC_REGISTER_LOWER.13 | v72.39,86.36 69.85,86.36 69.85,90.17 67.31,92.71 | 67.31,92.71 64.14,95.89 64.14,97.16 | 64.14,97.16 ADDR_REG_PARAM_LOWER.13 | OUTPUT_BUFFER_LOGIC.16 111.76,121.92 v111.76,128.27 111.76,139.06 v112.39,139.7 | 156.21,168.91 146.69,159.38 146.69,158.12 OUTPUT_BUFFER_REG_A.13 | 156.21,168.91 v156.84,169.54 | 156.21,168.91 v156.21,212.09 | v173.35,267.33 170.18,264.16 170.18,236.22 168.28,234.31 v168.28,225.43 | OUTPUT_BUFFER_ALU.4 v168.91,222.25
8_PLACE  (via drill 0.35)
  Top 0.152: OUTPUT_BUFFER_MEMORY.14 82.55,246.38 v59.05,246.38 | v177.8,268.61 188.59,268.61 189.23,267.97 216.53,267.97 217.81,269.24 220.98,269.24 PROGRAM_COUNTER_LOWER.6 | OUTPUT_BUFFER_PC.14 173.99,271.78 172.72,273.05 v162.56,273.05 142.88,273.05 v130.18,285.75 128.91,285.75 119.38,276.23 108.58,276.23 v105.41,273.05 | 145.41,159.38 146.69,160.66 170.18,160.66 | 170.18,160.66 172.72,160.66 175.9,163.83 v183.51,163.83 | 170.18,160.66 v170.18,161.29 | INSTRUC_REGISTER_LOWER.14 76.83,132.08 78.11,133.35 87.63,133.35 OUTPUT_BUFFER_INSTRUCTION.14 106.68,134.62 v111.12,130.18 118.75,137.79 126.36,137.79 v139.7,151.13 | XOR_GATE_1.13 136.53,17.14 137.79,17.14 138.43,17.78 138.43,22.23 | 138.43,22.23 138.43,22.86 95.25,22.86 93.98,24.13 OUTPUT_BUFFER_FLAGS.5 OUTPUT_BUFFER_RAM.15 | v174.62,36.2 161.93,23.5 142.24,23.5 140.97,22.23 138.43,22.23 | v62.23,87.63 62.87,87 73.03,87 78.74,81.28 88.9,81.28 90.17,80.01 OUTPUT_BUFFER_PARAM_REG.14 | 145.41,159.38 144.78,160.02 v140.34,160.02 | 145.41,159.38 OUTPUT_BUFFER_REG_A.14 | v162.56,217.17 163.83,215.9 OUTPUT_BUFFER_ALU.5
  Bottom 0.152: MICRO_COUNTER_LOWER.6 58.42,207.01 58.42,246.38 | 58.42,246.38 58.42,261.62 52.07,267.97 52.07,274.32 50.8,275.59 ADDR_MEM_REG_LOWER.14 | 58.42,246.38 v59.05,246.38 | EXTENSION.4 118.11,309.25 118.75,309.88 121.28,309.88 121.92,309.25 121.92,299.72 DATABUS_4.A 130.18,291.46 v130.18,285.75 | OUTPUT_BUFFER_PC.14 177.8,269.24 v177.8,268.61 | OUTPUT_BUFFER_MEMORY.14 92.71,256.54 99.06,256.54 99.06,266.7 v105.41,273.05 | v183.51,163.83 184.15,164.47 ADDR_REG_A_LOWER.14 | OUTPUT_BUFFER_ALU.5 170.18,210.82 v170.18,161.29 | 61.59,97.16 64.14,99.69 64.14,128.91 INSTRUC_REGISTER_LOWER.14 | OUTPUT_BUFFER_LOGIC.15 111.12,120.02 v111.12,130.18 | RAM_ADDR_LOWER.11 60.33,8.89 60.33,22.23 OUTPUT_BUFFER_RAM.15 | ADDR_REG_CALC_LOWER.14 199.39,46.35 193.68,46.35 193.04,45.72 193.04,41.91 OUTPUT_BUFFER_CALC_REG.14 174.62,38.73 v174.62,36.2 | OUTPUT_BUFFER_PARAM_REG.14 94.61,76.83 94.61,26.04 OUTPUT_BUFFER_FLAGS.5 | 61.59,97.16 62.23,96.52 v62.23,87.63 | 61.59,97.16 ADDR_REG_PARAM_LOWER.14 | v140.34,160.02 139.7,159.38 v139.7,151.13 | v162.56,217.17 v162.56,273.05
16_PLACE  (via drill 0.35)
  Top 0.152: v190.5,274.32 OUTPUT_BUFFER_PC.15 173.99,274.32 172.72,275.59 v161.93,275.59 156.84,275.59 147.32,285.12 132.72,285.12 125.09,292.74 | DATABUS_5.A 119.38,297.18 120.65,297.18 125.09,292.74 | OUTPUT_BUFFER_MEMORY.15 82.55,248.92 v33.66,248.92 | 125.09,292.74 110.49,278.13 v104.78,278.13 | ADDR_REG_A_UPPER.11 168.91,165.1 165.1,161.29 OUTPUT_BUFFER_REG_A.15 139.7,161.29 138.43,160.02 v132.72,160.02 | INSTRUC_REGISTER_UPPER.11 74.93,140.97 82.55,140.97 85.09,138.43 85.09,137.16 OUTPUT_BUFFER_INSTRUCTION.15 v95.89,137.16 105.41,137.16 108.58,133.99 | 108.58,133.99 v110.49,132.08 | 108.58,133.99 v128.91,154.31 | ADDR_REG_CALC_UPPER.11 212.09,46.99 186.69,46.99 184.15,44.45 OUTPUT_BUFFER_CALC_REG.15 176.53,43.18 137.79,43.18 98.42,82.55 OUTPUT_BUFFER_PARAM_REG.15 | v40.64,22.86 59.69,22.86 60.96,21.59 OUTPUT_BUFFER_RAM.14 OUTPUT_BUFFER_FLAGS.6 93.98,21.59 95.25,20.32 107.95,20.32 v110.49,17.78 | v161.93,212.72 162.56,213.36 OUTPUT_BUFFER_ALU.6
  Bottom 0.152: DATABUS_5.A 120.65,298.45 EXTENSION.5 | v190.5,274.32 PROGRAM_COUNTER_UPPER.3 | MICRO_COUNTER_UPPER.3 33.02,212.09 33.02,248.92 | 33.02,248.92 33.02,274.32 34.29,275.59 ADDR_MEM_REG_UPPER.11 | 33.02,248.92 v33.66,248.92 | v104.78,278.13 102.87,276.23 102.87,271.14 95.89,264.16 95.89,259.71 95.25,259.08 88.27,259.08 88.27,254.63 OUTPUT_BUFFER_MEMORY.15 | OUTPUT_BUFFER_ALU.6 168.91,209.55 ADDR_REG_A_UPPER.11 | OUTPUT_BUFFER_LOGIC.14 110.49,118.11 v110.49,132.08 | v132.72,160.02 128.91,156.21 v128.91,154.31 | 40.64,38.1 RAM_ADDR_UPPER.14 | v40.64,22.86 40.64,38.1 | XOR_GATE_2.2 110.49,15.24 v110.49,17.78 | ADDR_REG_PARAM_UPPER.11 43.18,95.25 43.18,67.94 41.91,66.67 41.91,46.99 40.64,45.72 40.64,38.1 | 92.08,81.92 95.25,78.74 95.25,24.13 OUTPUT_BUFFER_FLAGS.6 | v95.89,137.16 95.89,85.72 92.08,81.92 | 92.08,81.92 OUTPUT_BUFFER_PARAM_REG.15 | v161.93,212.72 v161.93,275.59
32_PLACE  (via drill 0.35)
  Top 0.152: ADDR_REG_CALC_UPPER.12 219.71,46.99 219.71,48.26 v184.15,48.26 | v45.09,22.23 46.99,20.32 59.69,20.32 60.96,19.05 OUTPUT_BUFFER_RAM.13 OUTPUT_BUFFER_FLAGS.7 93.98,19.05 95.25,17.78 102.87,17.78 104.14,16.51 116.84,16.51 121.28,12.06 | v39.37,38.73 40.01,38.1 RAM_ADDR_UPPER.13 | v173.99,31.75 158.12,15.88 125.09,15.88 121.28,12.06 | 121.28,12.06 XOR_GATE_2.5 | ADDR_MEM_REG_UPPER.12 36.2,272.42 58.42,272.42 59.05,271.78 64.77,271.78 74.93,261.62 77.47,261.62 78.74,260.35 | 78.74,260.35 82.55,256.54 85.09,256.54 85.72,255.91 85.72,252.73 OUTPUT_BUFFER_MEMORY.16 | OUTPUT_BUFFER_PC.16 177.16,276.86 177.8,276.23 v179.07,276.23 v192.41,276.23 | EXTENSION.6 121.28,306.7 | 121.28,306.7 DATABUS_6.A | v170.81,287.65 165.1,293.37 147.96,293.37 134.62,306.7 121.28,306.7 | 78.74,260.35 90.17,271.78 v109.86,271.78 | OUTPUT_BUFFER_REG_A.16 163.83,163.83 ADDR_REG_A_UPPER.12 | INSTRUC_REGISTER_UPPER.12 74.93,143.51 83.82,143.51 87.63,139.7 OUTPUT_BUFFER_INSTRUCTION.16 95.89,139.7 113.67,157.48 140.97,157.48 v141.6,158.12 | 95.25,88.9 111.12,104.78 v113.67,104.78 | 95.25,88.9 OUTPUT_BUFFER_PARAM_REG.16 | v87,125.09 100.33,111.76 113.03,111.76 114.3,110.49 OUTPUT_BUFFER_LOGIC.13 | v170.18,214.63 166.37,210.82 OUTPUT_BUFFER_ALU.7 | v40.64,91.44 41.91,92.71 68.58,92.71 69.22,92.08 81.92,92.08 82.55,91.44 87.63,91.44 90.17,88.9 95.25,88.9
  Bottom 0.152: v184.15,48.26 182.88,46.99 OUTPUT_BUFFER_CALC_REG.16 173.99,43.18 v173.99,31.75 | RAM_ADDR_UPPER.13 45.09,36.2 v45.09,22.23 | ADDR_REG_PARAM_UPPER.12 40.64,95.25 v40.64,91.44 40.64,56.52 39.37,55.24 v39.37,38.73 | v192.41,276.23 195.58,273.05 PROGRAM_COUNTER_UPPER.4 | OUTPUT_BUFFER_PC.16 170.81,281.31 v170.81,287.65 | v109.86,271.78 110.49,272.42 DATABUS_6.A | OUTPUT_BUFFER_ALU.7 167,208.91 167,194.31 166.37,193.68 ADDR_REG_A_UPPER.12 | v113.67,104.78 113.67,108.58 OUTPUT_BUFFER_LOGIC.13 | OUTPUT_BUFFER_INSTRUCTION.16 87,137.79 v87,125.09 | OUTPUT_BUFFER_REG_A.16 141.6,160.66 v141.6,158.12 | v179.07,276.23 179.07,255.91 175.9,252.73 175.9,233.04 170.18,227.33 v170.18,214.63
64_PLACE  (via drill 0.35)
  Top 0.152: 175.9,278.76 177.8,276.86 193.04,276.86 v193.68,276.23 | ADDR_MEM_REG_UPPER.13 35.56,270.51 35.56,261.62 68.58,261.62 73.66,256.54 81.28,256.54 82.55,255.27 OUTPUT_BUFFER_MEMORY.17 | DATABUS_7.A 103.5,295.91 104.78,297.18 111.12,297.18 121.92,307.98 121.92,309.25 122.56,309.88 124.46,309.88 EXTENSION.7 126.36,308.61 127.64,307.34 134.62,307.34 147.96,294 165.74,294 v172.09,287.65 | ADDR_REG_CALC_UPPER.13 219.71,45.72 220.34,46.35 220.34,48.9 182.88,48.9 v182.25,49.53 | OUTPUT_BUFFER_RAM.12 OUTPUT_BUFFER_FLAGS.8 93.98,16.51 95.25,15.24 v105.41,15.24 | v64.77,35.56 RAM_ADDR_UPPER.12 | 121.28,18.41 120.02,17.14 v107.31,17.14 | v172.72,31.75 157.48,16.51 123.19,16.51 121.28,18.41 | 121.28,18.41 XOR_GATE_2.10 | 145.41,165.74 146.69,164.47 161.93,164.47 ADDR_REG_A_UPPER.13 | INSTRUC_REGISTER_UPPER.13 72.39,153.67 80.01,146.05 83.82,146.05 87.63,142.24 OUTPUT_BUFFER_INSTRUCTION.17 90.17,142.24 v109.86,161.93 | 96.52,92.71 107.31,103.5 108.58,103.5 113.03,107.95 OUTPUT_BUFFER_LOGIC.12 | 96.52,92.71 v95.25,91.44 | ADDR_REG_PARAM_UPPER.13 41.91,99.06 90.17,99.06 | 96.52,92.71 90.17,99.06 | 90.17,99.06 v90.81,99.69 | 145.41,165.74 144.78,165.1 v113.03,165.1 | 145.41,165.74 OUTPUT_BUFFER_REG_A.17 | v88.27,85.72 90.17,87.63 OUTPUT_BUFFER_PARAM_REG.17 | 175.9,278.76 175.26,278.13 v163.19,278.13 | 175.9,278.76 OUTPUT_BUFFER_PC.17
  Bottom 0.152: PROGRAM_COUNTER_UPPER.5 v193.68,276.23 | OUTPUT_BUFFER_MEMORY.17 102.23,273.69 102.23,294.64 102.87,295.27 DATABUS_7.A | OUTPUT_BUFFER_PC.17 172.09,282.57 v172.09,287.65 | v182.25,49.53 OUTPUT_BUFFER_CALC_REG.17 173.35,45.09 173.35,32.38 v172.72,31.75 | OUTPUT_BUFFER_RAM.12 64.14,18.41 64.14,34.92 v64.77,35.56 88.27,59.05 v88.27,85.72 | v105.41,15.24 v107.31,17.14 | 163.19,206.38 OUTPUT_BUFFER_ALU.8 | 163.19,206.38 163.19,167.64 163.83,167 ADDR_REG_A_UPPER.13 | v95.25,91.44 OUTPUT_BUFFER_PARAM_REG.17 | OUTPUT_BUFFER_INSTRUCTION.17 90.81,140.34 v90.81,99.69 | v109.86,161.93 v113.03,165.1 | 163.19,206.38 v163.19,278.13
128_PLACE  (via drill 0.35)
  Top 0.152: v160.02,168.91 OUTPUT_BUFFER_REG_A.18 | v162.56,205.74 OUTPUT_BUFFER_ALU.9 | v190.5,281.94 OUTPUT_BUFFER_PC.18 173.99,283.21 161.29,283.21 | v40.01,294 41.91,295.91 DATABUS_8.A 95.89,295.91 97.16,297.18 104.14,297.18 113.03,306.07 119.38,306.07 119.38,309.25 120.65,310.51 126.36,310.51 EXTENSION.8 | 161.29,283.21 153.03,283.21 142.88,293.37 134.62,293.37 v128.27,299.72 | 161.29,283.21 v161.29,282.57 | OUTPUT_BUFFER_FLAGS.9 OUTPUT_BUFFER_RAM.11 60.96,13.97 v59.69,15.24 | v46.35,33.02 RAM_ADDR_UPPER.11 v40.01,33.02 | v219.07,47.62 183.51,47.62 182.25,48.9 181.61,48.9 180.97,49.53 180.97,52.07 OUTPUT_BUFFER_CALC_REG.18 172.72,52.07 171.45,50.8 167,50.8 v131.44,86.36 | INSTRUC_REGISTER_UPPER.14 69.22,154.31 79.38,154.31 OUTPUT_BUFFER_INSTRUCTION.18 | v39.37,93.98 86.36,93.98 90.17,90.17 OUTPUT_BUFFER_PARAM_REG.18 95.89,90.17 111.12,105.41 114.94,105.41 | 114.94,105.41 v116.84,103.5 | 114.94,105.41 OUTPUT_BUFFER_LOGIC.11 | v141.6,169.54 139.7,167.64 128.91,167.64 127,165.74 104.78,165.74 98.42,159.38 v92.71,159.38
  Bottom 0.152: 161.29,167.64 v160.02,168.91 | 161.29,167.64 161.29,204.47 v162.56,205.74 161.29,207.01 v161.29,282.57 | 161.29,167.64 ADDR_REG_A_UPPER.14 | v190.5,281.94 191.77,280.67 191.77,278.13 193.04,276.86 200.66,276.86 PROGRAM_COUNTER_UPPER.6 | OUTPUT_BUFFER_MEMORY.18 95.25,269.24 DATABUS_8.A | ADDR_MEM_REG_UPPER.14 40.01,290.19 v40.01,294 | EXTENSION.8 v128.27,299.72 | v46.35,33.02 50.16,29.21 50.16,16.51 51.44,15.24 v59.69,15.24 | v219.07,47.62 ADDR_REG_CALC_UPPER.14 | v39.37,93.98 38.1,95.25 | 38.1,95.25 ADDR_REG_PARAM_UPPER.14 | 91.44,142.24 OUTPUT_BUFFER_INSTRUCTION.18 | 91.44,142.24 91.44,97.79 89.53,95.89 89.53,92.08 OUTPUT_BUFFER_PARAM_REG.18 | v131.44,86.36 116.84,100.97 v116.84,103.5 | v40.01,33.02 37.47,35.56 37.47,53.34 36.83,53.98 36.83,67.94 38.1,69.22 38.1,95.25 | OUTPUT_BUFFER_REG_A.18 141.6,168.91 v141.6,169.54 | v92.71,159.38 91.44,158.12 91.44,142.24
>0_FLAG  (via drill 0.35)
  Top 0.152: 158.75,181.61 161.93,181.61 169.54,173.99 203.2,173.99 207.01,170.18 ZERO_POS_FLAG_IDENTIFIER.1 | 158.75,181.61 v118.11,181.61 | v160.66,254 POSITIVE_FLAG.A | 158.75,181.61 v158.75,182.25
  Bottom 0.152: AND_GATE4_.5 111.76,207.01 111.76,187.96 v118.11,181.61 | v160.66,254 158.75,252.09 v158.75,182.25
AND_OR_ON/OFF  (via drill 0.35)
  Top 0.152: 142.88,100.97 LOGIC_SELECTOR-AND/OR_UPPER.15 | 142.88,100.97 161.93,100.97 LOGIC_SELECTOR-AND/OR_LOWER.15 | v129.54,205.1 v129.54,207.65 | v128.27,103.5 128.27,101.6 133.99,101.6 134.62,100.97 142.88,100.97
  Bottom 0.152: AND_GATE_.11 123.83,248.28 123.83,245.75 128.27,241.3 128.27,208.91 v129.54,207.65 | v129.54,205.1 128.27,203.84 v128.27,103.5
CALC_IN  (via drill 0.35)
  Top 0.152: ADDR_REG_CALC_UPPER.10 ADDR_REG_CALC_UPPER.9 207.65,46.35 191.13,46.35 ADDR_REG_CALC_LOWER.10 ADDR_REG_CALC_LOWER.9 | SELECTOR_LOGIC2_.10 71.75,172.09 v100.33,172.09 | v104.14,93.34 149.22,48.26 182.25,48.26 183.51,46.99 v185.42,46.99
  Bottom 0.152: v100.33,172.09 100.33,97.16 v104.14,93.34 | v185.42,46.99 186.69,45.72 ADDR_REG_CALC_LOWER.9
CALC_OUT  (via drill 0.35)
  Top 0.152: v174.62,60.96 148.59,87 112.39,87 v104.14,95.25 | SELECTOR_LOGIC2_.11 v100.97,179.07
  Bottom 0.152: OUTPUT_BUFFER_CALC_REG.19 174.62,57.78 v174.62,60.96 | v104.14,95.25 100.97,98.42 v100.97,179.07
CLOCK  (via drill 0.35)
  Top 0.152: ADDR_MEM_REG_UPPER.7 39.37,271.78 58.42,271.78 ADDR_MEM_REG_LOWER.7 | PROGRAM_COUNTER_LOWER.2 210.82,274.32 193.04,274.32 PROGRAM_COUNTER_UPPER.2 188.59,273.69 179.71,273.69 176.53,270.51 v131.44,270.51 129.54,272.42 v59.69,272.42 | AND_GATE_.8 121.28,243.21 v130.81,243.21 | ADDR_REG_PARAM_UPPER.7 49.53,91.44 v59.69,91.44 68.58,91.44 ADDR_REG_PARAM_LOWER.7 | ADDR_REG_A_UPPER.7 173.99,161.29 191.77,161.29 ADDR_REG_A_LOWER.7 194.31,155.57 v203.2,146.69 | ADDR_REG_CALC_LOWER.7 191.77,49.53 209.55,49.53 ADDR_REG_CALC_UPPER.7 | 133.99,34.92 132.08,36.83 114.3,36.83 FLAG_REG_LOWER.7 109.22,36.83 67.31,36.83 63.5,33.02 50.16,33.02 | 50.16,33.02 47.62,33.02 46.35,31.75 38.1,31.75 36.83,30.48 RAM_ADDR_UPPER.7 | v174.62,40.01 172.72,38.1 137.16,38.1 133.99,34.92 | 133.99,34.92 FLAG_REG_UPPER.7 | 50.16,33.02 v50.16,33.66
  Bottom 0.152: CLOCK.A v59.69,272.42 59.69,271.78 60.96,270.51 ADDR_MEM_REG_LOWER.7 60.96,195.58 57.78,192.41 57.78,144.15 | NOT_GATE1.11 130.81,236.22 v130.81,243.21 130.81,270.51 | 130.81,270.51 EXTENSION.9 | 130.81,270.51 v131.44,270.51 | 57.78,144.15 57.78,123.83 INSTRUC_REGISTER_LOWER.7 57.78,120.02 57.78,99.69 59.69,97.79 v59.69,91.44 | INSTRUC_REGISTER_UPPER.7 57.78,144.15 | RAM_ADDR_LOWER.7 33.66,8.26 33.66,28.57 RAM_ADDR_UPPER.7 | ADDR_REG_CALC_LOWER.7 180.34,43.18 174.62,43.18 v174.62,40.01 | v203.2,146.69 207.01,142.88 207.01,58.42 212.09,53.34 ADDR_REG_CALC_UPPER.7 | ADDR_REG_PARAM_UPPER.7 45.72,87.63 45.72,59.05 50.16,54.61 v50.16,33.66
CLR_REG  (via drill 0.35)
  Top 0.152: FLAG_REG_LOWER.15 126.36,24.77 145.41,24.77 FLAG_REG_UPPER.15 | ADDR_REG_CALC_LOWER.15 203.84,42.55 222.88,42.55 ADDR_REG_CALC_UPPER.15 | 35.56,95.25 36.2,94.61 56.52,94.61 ADDR_REG_PARAM_LOWER.15 | 35.56,95.25 ADDR_REG_PARAM_UPPER.15 | 35.56,95.25 29.84,89.53 29.84,55.88 30.48,55.88 RAM_ADDR_UPPER.15 44.45,43.18 46.99,45.72 120.02,45.72 v125.73,40.01 | ADDR_MEM_REG_UPPER.15 26.04,278.76 46.35,278.76 ADDR_MEM_REG_LOWER.15 50.16,278.76 v61.59,278.76 | ADDR_REG_A_UPPER.15 160.66,168.28 167.64,168.28 | 167.64,168.28 179.71,168.28 ADDR_REG_A_LOWER.15 | R81.1 109.22,187.96 RESET_REGS.4 | 104.78,162.56 100.97,158.75 INSTRUC_REGISTER_UPPER.15 | 104.78,162.56 v106.68,164.47 | 167.64,168.28 167.64,164.47 166.37,164.47 164.47,162.56 104.78,162.56 | v57.15,130.18 57.78,130.81 62.23,130.81 66.04,134.62 INSTRUC_REGISTER_LOWER.15
  Bottom 0.152: FLAG_REG_UPPER.15 151.76,31.11 201.93,31.11 ADDR_REG_CALC_LOWER.15 | RAM_ADDR_LOWER.15 45.72,21.59 45.72,40.64 RAM_ADDR_UPPER.15 | INSTRUC_REGISTER_LOWER.15 64.77,137.16 64.77,156.21 INSTRUC_REGISTER_UPPER.15 69.85,161.29 69.85,249.56 62.23,257.18 62.23,278.13 v61.59,278.76 | R81.1 106.68,182.88 v106.68,164.47 | ADDR_REG_PARAM_LOWER.15 57.15,97.79 v57.15,130.18 | FLAG_REG_LOWER.15 125.73,27.94 v125.73,40.01
COUNTERS_CLEAR  (via drill 0.35)
  Top 0.152: R80.1 163.19,304.17 165.1,304.17 165.74,303.53 166.37,303.53 RESET_PC.1 | AND_GATE4_.10 118.11,210.82 158.75,210.82 162.56,214.63 168.91,214.63 v170.81,216.53 | PROGRAM_COUNTER_LOWER.1 208.28,269.24 190.5,269.24 PROGRAM_COUNTER_UPPER.1
  Bottom 0.152: v170.81,216.53 170.81,227.33 179.07,235.59 179.07,255.27 187.96,264.16 PROGRAM_COUNTER_UPPER.1 187.96,273.05 186.06,274.95 186.06,283.85 167,302.89 RESET_PC.1
CTRL_SIG_1  (via drill 0.35)
  Top 0.152: 38.73,118.75 34.92,122.56 23.5,122.56 5.08,140.97 5.08,148.59 INSTRUCTION_MEMORY_0.11 | 38.73,118.75 INSRUCTION_REGISTER_SELECTOR_LOWER.13 | v73.03,130.18 71.12,128.27 66.04,128.27 60.96,123.19 43.18,123.19 38.73,118.75
  Bottom 0.152: OUTPUT_BUFFER_INSTRUCTION.2 73.03,139.06 v73.03,130.18
CTRL_SIG_2  (via drill 0.35)
  Top 0.152: INSTRUCTION_MEMORY_0.12 25.4,128.27 44.45,128.27 v48.9,123.83 | v74.93,115.57 53.34,115.57 52.07,114.3 INSRUCTION_REGISTER_SELECTOR_LOWER.10
  Bottom 0.152: v48.9,123.83 52.07,120.65 INSRUCTION_REGISTER_SELECTOR_LOWER.10 | OUTPUT_BUFFER_INSTRUCTION.3 83.19,142.88 83.19,123.83 v74.93,115.57
CTRL_SIG_3  (via drill 0.35)
  Top 0.152: INSTRUCTION_MEMORY_0.13 25.4,125.73 45.09,125.73 v46.99,123.83 | v76.83,139.06 59.05,139.06 v52.07,132.08
  Bottom 0.152: INSRUCTION_REGISTER_SELECTOR_LOWER.6 49.53,106.68 48.26,107.95 48.26,122.56 v46.99,123.83 49.53,126.36 49.53,129.54 v52.07,132.08 | OUTPUT_BUFFER_INSTRUCTION.4 76.83,142.24 v76.83,139.06
CTRL_SIG_4  (via drill 0.35)
  Top 0.152: 24.77,140.97 v25.4,140.34 | INSTRUCTION_MEMORY_0.15 24.77,140.97 | v78.11,139.7 54.61,139.7 52.7,137.79 47.62,137.79 44.45,140.97 24.77,140.97
  Bottom 0.152: INSRUCTION_REGISTER_SELECTOR_LOWER.3 40.01,103.5 30.48,103.5 30.48,119.38 25.4,124.46 v25.4,140.34 | v78.11,139.7 OUTPUT_BUFFER_INSTRUCTION.5
CTRL_SIG_5  (via drill 0.35)
  Top 0.152: OUTPUT_BUFFER_INSTRUCTION.6 77.47,133.35 66.04,133.35 60.96,128.27 53.34,128.27 45.72,135.89 37.47,135.89 35.56,137.79 29.84,137.79 29.21,138.43 v24.77,138.43
  Bottom 0.152: INSRUCTION_REGISTER_SELECTOR_UPPER.13 24.77,116.2 v24.77,138.43 24.77,141.6 INSTRUCTION_MEMORY_0.16
CTRL_SIG_6  (via drill 0.35)
  Top 0.152: 28.57,112.39 26.67,110.49 24.13,110.49 22.86,111.76 v22.86,121.92 | v73.03,114.3 68.58,109.86 31.11,109.86 28.57,112.39 | 28.57,112.39 INSRUCTION_REGISTER_SELECTOR_UPPER.10
  Bottom 0.152: v22.86,121.92 20.95,123.83 20.95,144.15 INSTRUCTION_MEMORY_0.17 | OUTPUT_BUFFER_INSTRUCTION.7 73.03,126.36 v73.03,114.3
CTRL_SIG_7  (via drill 0.35)
  Top 0.152: v69.22,102.23 29.84,102.23 INSRUCTION_REGISTER_SELECTOR_UPPER.6
  Bottom 0.152: INSRUCTION_REGISTER_SELECTOR_UPPER.6 20.32,111.76 20.32,146.05 INSTRUCTION_MEMORY_0.18 | OUTPUT_BUFFER_INSTRUCTION.8 73.66,124.46 73.66,106.68 v69.22,102.23
CTRL_SIG_8  (via drill 0.35)
  Top 0.152: v69.22,100.97 23.5,100.97 INSRUCTION_REGISTER_SELECTOR_UPPER.3
  Bottom 0.152: INSRUCTION_REGISTER_SELECTOR_UPPER.3 17.78,106.68 17.78,146.05 INSTRUCTION_MEMORY_0.19 | OUTPUT_BUFFER_INSTRUCTION.9 74.3,122.56 74.3,106.05 v69.22,100.97
CTRL_SIG_9  (via drill 0.35)
  Top 0.152: INSTRUCTION_MEMORY_1.11 29.21,133.35 v37.47,133.35 | v38.73,173.35 41.91,176.53 51.44,176.53 57.78,182.88 64.77,182.88 66.04,184.15 SELECTOR_LOGIC2_.13
  Bottom 0.152: v37.47,133.35 38.73,134.62 v38.73,173.35
CTRL_SIG_10  (via drill 0.35)
  Top 0.152: v33.02,175.26 41.91,184.15 51.44,184.15 55.24,187.96 64.77,187.96 66.04,186.69 SELECTOR_LOGIC2_.14
  Bottom 0.152: INSTRUCTION_MEMORY_1.12 33.02,134.62 v33.02,175.26
CTRL_SIG_11  (via drill 0.35)
  Top 0.152: v45.72,208.28 48.9,211.46 76.83,211.46 v84.45,219.07 | v93.34,227.97 110.49,245.11 111.76,245.11 115.57,248.92 127,248.92 129.54,246.38 138.43,246.38 139.7,247.65 NOT_GATE3_.3
  Bottom 0.152: INSTRUCTION_MEMORY_1.13 35.56,134.62 35.56,165.1 33.66,167 33.66,192.41 45.72,204.47 v45.72,208.28 | v93.34,227.97 v84.45,219.07
CTRL_SIG_12  (via drill 0.35)
  Top 0.152: SUBTRACT_INVRTR_UPPER_.12 200.03,214 203.84,214 SUBTRACT_INVRTR_UPPER_.9 207.65,214 208.91,214 210.82,212.09 | 210.82,212.09 214.63,208.28 214.63,206.38 | SUBTRACT_INVRTR_LOWER_.1 214.63,206.38 | SUBTRACT_INVRTR_LOWER_.4 220.34,206.38 214.63,206.38 | v52.7,200.03 188.59,200.03 191.13,202.56 | SUBTRACT_INVRTR_UPPER_.1 191.13,202.56 | 191.13,202.56 198.75,202.56 SUBTRACT_INVRTR_UPPER_.4 202.56,206.38 205.1,206.38 210.82,212.09
  Bottom 0.152: SUBTRACT_INVRTR_LOWER_.4 227.33,209.55 SUBTRACT_INVRTR_LOWER_.9 227.33,212.72 227.97,213.36 227.97,221.62 ADDER_LOWER.7 | SUBTRACT_INVRTR_LOWER_.1 219.07,208.91 219.07,210.82 219.71,211.46 SUBTRACT_INVRTR_LOWER_.12 | INSTRUCTION_MEMORY_1.15 45.09,126.36 45.09,144.78 46.99,146.69 46.99,188.59 52.7,194.31 v52.7,200.03
CTRL_SIG_13  (via drill 0.35)
  Top 0.152: v36.83,191.77 43.18,198.12 v137.79,198.12
  Bottom 0.152: INSTRUCTION_MEMORY_1.16 37.47,132.72 36.83,132.72 v36.83,191.77 | v137.79,198.12 137.79,234.31 135.89,236.22 135.89,237.49 134.62,238.76 NOT_GATE1.13
CTRL_SIG_14  (via drill 0.35)
  Top 0.152: v39.37,191.77 41.91,194.31 100.33,194.31 102.87,196.85 v142.24,196.85
  Bottom 0.152: INSTRUCTION_MEMORY_1.17 39.37,133.35 v39.37,191.77 | v142.24,196.85 143.51,198.12 143.51,210.19 146.69,213.36 146.69,220.34 NOT_GATE4_.11
CTRL_SIG_15  (via drill 0.35)
  Top 0.152: v40.01,187.32 41.91,189.23 SELECTOR_LOGIC2_.2
  Bottom 0.152: INSTRUCTION_MEMORY_1.18 40.01,135.25 v40.01,187.32
CTRL_SIG_16  (via drill 0.35)
  Top 0.152: v45.72,134.62 INSTRUCTION_MEMORY_1.19 | v47.62,178.44 55.88,186.69 SELECTOR_LOGIC2_.3
  Bottom 0.152: v45.72,134.62 47.62,136.53 v47.62,178.44
CTRL_SIG_17_(FLAG_OUT)  (via drill 0.35)
  Top 0.152: INSTRUCTION_MEMORY_2.11 26.04,172.09 26.04,179.07 29.21,179.07 41.91,191.77 57.15,191.77 59.05,193.68 v70.48,193.68 | v79.38,233.04 91.44,245.11 91.44,264.16 123.19,264.16 124.46,262.89 NOT_GATE_.1
  Bottom 0.152: v70.48,193.68 79.38,202.56 v79.38,233.04
CTRL_SIG_18_(LOGIC_SELECT_1)  (via drill 0.35)
  Top 0.152: LOGIC_SELECTOR-XOR/NOT_LOWER.1 210.19,91.44 207.65,93.98 190.5,93.98 LOGIC_SELECTOR-XOR/NOT_UPPER.1 185.42,93.98 158.12,93.98 | SELECTOR_LOGIC_.2 212.72,241.94 v201.29,241.94 | 158.12,93.98 140.97,93.98 LOGIC_SELECTOR-AND/OR_UPPER.1 133.99,91.44 130.18,95.25 105.41,95.25 v104.14,96.52 | 158.12,93.98 160.66,91.44 LOGIC_SELECTOR-AND/OR_LOWER.1 | v34.29,167.64 INSTRUCTION_MEMORY_2.12 | v41.91,120.65 46.35,116.2 95.25,116.2 v101.6,109.86
  Bottom 0.152: v201.29,241.94 191.77,232.41 191.77,213.36 189.87,211.46 189.87,194.31 189.23,193.68 189.23,175.9 187.96,174.62 187.96,156.84 186.69,155.57 186.69,140.34 186.06,139.7 186.06,94.61 187.96,92.71 LOGIC_SELECTOR-XOR/NOT_UPPER.1 | v34.29,167.64 36.2,165.74 36.2,126.36 v41.91,120.65 | v101.6,109.86 104.14,107.31 v104.14,96.52
CTRL_SIG_19_(LOGIC_SELECT_2)  (via drill 0.35)
  Top 0.152: INSTRUCTION_MEMORY_2.13 31.75,161.29 57.15,161.29 59.69,163.83 v73.03,163.83 | v84.45,177.16 85.72,178.44 107.95,178.44 119.38,189.87 200.66,189.87 209.55,198.75 v212.09,198.75
  Bottom 0.152: v73.03,163.83 84.45,175.26 v84.45,177.16 | v212.09,198.75 212.72,199.39 212.72,216.53 218.44,222.25 218.44,227.33 220.98,229.87 220.98,243.84 219.71,245.11 SELECTOR_LOGIC_.3
CTRL_SIG_20_(LOGIC_OUT)  (via drill 0.35)
  Top 0.152: INSTRUCTION_MEMORY_2.15 50.16,162.56 51.44,163.83 59.05,163.83 59.69,164.47 102.87,164.47 v105.41,167
  Bottom 0.152: v105.41,167 106.05,167.64 106.05,252.73 107.31,254 107.31,260.99 107.95,261.62 123.83,261.62 123.83,259.71 NOT_GATE_.3
CTRL_SIG_21_(P_REG_IN)  (via drill 0.35)
  Top 0.152: INSTRUCTION_MEMORY_2.16 50.16,165.1 51.44,166.37 93.34,166.37 95.25,168.28 v120.65,168.28 | v121.28,214 121.92,214.63 NOT_GATE2_.3
  Bottom 0.152: v120.65,168.28 121.28,168.91 v121.28,214
CTRL_SIG_22_(P_REG_OUT)  (via drill 0.35)
  Top 0.152: INSTRUCTION_MEMORY_2.17 50.16,167.64 51.44,168.91 117.47,168.91 v119.38,170.81
  Bottom 0.152: v119.38,170.81 119.38,213.36 NOT_GATE2_.1
CTRL_SIG_23_(LOOP_CONTROL_B)  (via drill 0.35)
  Top 0.152: INSTRUCTION_MEMORY_2.18 50.16,170.18 51.44,171.45 106.68,171.45 117.47,182.25 v142.24,182.25 | v153.67,241.94 154.31,242.57 191.77,242.57 BRANCH_SELECTOR.3
  Bottom 0.152: v142.24,182.25 149.22,189.23 149.22,212.72 153.67,217.17 v153.67,241.94
CTRL_SIG_24_(LOOP_CONTROL_A)  (via drill 0.35)
  Top 0.152: INSTRUCTION_MEMORY_2.19 50.16,172.72 51.44,173.99 54.61,173.99 58.42,177.8 60.96,177.8 66.04,182.88 90.17,182.88 99.06,191.77 104.78,191.77 107.95,194.94 146.05,194.94 v149.86,198.75 | v158.12,243.21 189.87,243.21 BRANCH_SELECTOR.2
  Bottom 0.152: v149.86,198.75 154.31,203.2 154.31,239.4 v158.12,243.21
END_CRNT_CMD  (via drill 0.35)
  Top 0.152: v69.22,200.66 71.12,202.56 111.12,202.56 115.57,207.01 AND_GATE4_.9
  Bottom 0.152: SELECTOR_LOGIC2_.9 69.22,175.9 v69.22,200.66
END_CRNT_CMD&&BTN_PRESS  (via drill 0.35)
  Top 0.152: MICRO_COUNTER_UPPER.1 24.13,203.2 41.27,203.2 42.55,204.47 | 42.55,204.47 43.81,205.74 MICRO_COUNTER_LOWER.1 | v113.03,199.39 47.62,199.39 42.55,204.47
  Bottom 0.152: AND_GATE4_.8 113.03,200.66 v113.03,199.39
GND  (via drill 0.35)
  Top 0.152: R68.2 v177.8,86.36 | v177.8,90.17 LOGIC_SELECTOR-AND/OR_LOWER.8 180.34,90.17 v181.61,90.17 | v179.07,106.68 177.8,107.95 OR_GATE2_.7 175.91,107.95 174.36,106.4 164.47,106.4 v164.08,106.02 | v179.07,102.87 181.61,100.33 v181.61,99.06 | v11.43,171.45 9.17,169.19 9.17,168.54 8.65,168.02 6.59,168.02 6.07,168.54 6.07,169.28 7.35,170.56 8.65,170.56 9.17,171.08 9.17,171.82 8.65,172.34 6.17,172.34 5.41,171.58 5.41,151.42 6.59,150.24 7.89,150.24 9.17,148.96 9.17,148.22 8.65,147.7 7.35,147.7 6.07,146.42 6.07,143.14 7.62,141.59 INSTRUCTION_MEMORY_0.14 | v15.24,167.64 21.31,161.57 | 21.31,161.57 21.31,160.92 22.86,159.37 INSTRUCTION_MEMORY_0.22 | INSTRUCTION_MEMORY_0.20 24.75,153.67 26.91,151.51 28.97,151.51 29.86,152.4 v31.75,152.4 | RAM_ADDR_LOWER.1 v38.1,21.59 | v38.1,27.94 RAM_ADDR_UPPER.8 | OUTPUT_BUFFER_LOGIC.10 111.38,108.84 116.6,108.84 118.76,106.68 v119.38,106.68 | v119.38,115.57 121.92,118.11 OR_GATE3_.7 | R60.2 160.02,195.58 v162.56,198.12 165.1,195.58 v165.1,194.31 | v162.56,203.2 OUTPUT_BUFFER_ALU.10 | v165.1,191.77 166.37,193.04 R59.2 | SELECTOR_LOGIC2_.8 61.92,176.22 62.36,176.22 66.17,180.03 68.71,180.03 69.01,180.34 v91.44,180.34 v92.71,180.34 | v160.02,105.41 158.75,105.41 OR_GATE1_.7 | R12.1 185.42,254 v186.69,252.73 | v186.69,246.38 185.42,245.11 R14.1 | R31.2 v99.06,283.21 | INSTRUC_REGISTER_LOWER.8 v49.53,119.38 | SELECTOR_LOGIC2_.1 60.96,193.04 v91.44,193.04 | v91.44,204.47 AND_GATE4_.7 | OUTPUT_BUFFER_FLAGS.1 91.44,33.02 v87.63,33.02 | v88.9,11.43 OUTPUT_BUFFER_FLAGS.10 | R54.2 v208.28,195.58 | v200.66,151.13 198.12,153.67 R51.2 | OUTPUT_BUFFER_ALU.1 v165.1,228.6
  Top 0.152: INSTRUCTION_MEMORY_2.14 24.41,166.09 24.41,166.74 23.89,167.26 21.83,167.26 21.31,166.74 21.31,161.57
  Bottom 0.152: v177.8,86.36 v177.8,90.17 | v179.07,106.68 v179.07,102.87 | v181.61,99.06 v181.61,90.17 | v11.43,171.45 v15.24,167.64 | v31.75,152.4 v31.75,154.94 | v38.1,21.59 v38.1,27.94 | v25.4,109.22 v25.4,111.76 | v119.38,106.68 v119.38,115.57 | v162.56,198.12 v162.56,203.2 | v165.1,194.31 v165.1,191.77 | v91.44,180.34 91.44,166.37 v87.63,162.56 | v92.71,180.34 v92.71,175.26 | v164.08,106.02 163.47,105.41 v160.02,105.41 | v186.69,252.73 v186.69,246.38 | v99.06,283.21 v101.6,285.75 | v49.53,119.38 INSRUCTION_REGISTER_SELECTOR_LOWER.11 | v91.44,193.04 v91.44,204.47 | v87.63,33.02 87.63,12.7 v88.9,11.43 | v208.28,195.58 207.01,195.58 v205.74,196.85 | v200.66,147.32 v200.66,151.13 | v185.42,156.21 v185.42,152.4 | v165.1,228.6 165.1,232.41 v166.37,233.68
  pour Top: 0,317.5 0,0 242.57,0 246.38,3.81 246.38,317.5
HLT_SIGNAL  (via drill 0.35)
  Top 0.152: SELECTOR_LOGIC2_.7 62.23,176.53 66.04,180.34 68.58,180.34 v70.48,182.25 | v83.19,223.52 105.41,245.75 111.12,245.75 115.57,250.19 AND_GATE_.9
  Bottom 0.152: v70.48,182.25 80.01,191.77 80.01,220.34 v83.19,223.52
INSTRUCTION_A0
  Top 0.152: INSTRUCTION_MEMORY_2.10 40.64,172.72 41.91,173.99 50.16,173.99 51.44,175.26 INSTRUCTIONS_EXTENSION.1 | INSTRUCTION_MEMORY_0.10 24.13,134.62 INSTRUCTION_MEMORY_1.10 37.47,134.62 41.27,130.81 44.45,130.81 48.9,126.36 57.78,126.36 INSTRUC_REGISTER_LOWER.6
  Bottom 0.152: INSTRUCTION_MEMORY_2.10 26.04,170.81 26.04,136.53 INSTRUCTION_MEMORY_1.10
INSTRUCTION_A1  (via drill 0.35)
  Top 0.152: INSTRUCTION_MEMORY_0.9 20.32,140.97 20.32,139.06 22.86,139.06 24.77,137.16 INSTRUCTION_MEMORY_1.9 35.56,137.16 39.37,133.35 44.45,133.35 50.8,127 INSTRUC_REGISTER_LOWER.5 | INSTRUCTIONS_EXTENSION.2 50.8,171.45 v30.48,171.45
  Bottom 0.152: INSTRUCTION_MEMORY_2.9 29.84,173.35 29.84,171.45 | 29.84,171.45 29.84,139.06 INSTRUCTION_MEMORY_1.9 | 29.84,171.45 v30.48,171.45
INSTRUCTION_A2  (via drill 0.35)
  Top 0.152: v32.38,170.81 33.66,169.54 41.27,169.54 41.91,168.91 50.16,168.91 51.44,170.18 INSTRUCTIONS_EXTENSION.3 | INSTRUCTION_MEMORY_0.8 20.95,142.88 20.95,139.7 INSTRUCTION_MEMORY_1.8 29.21,139.7 29.84,139.06 | INSTRUC_REGISTER_LOWER.4 53.34,129.54 44.45,138.43 30.48,138.43 29.84,139.06 | 29.84,139.06 v30.48,139.7
  Bottom 0.152: INSTRUCTION_MEMORY_2.8 32.38,173.35 v32.38,170.81 30.48,168.91 v30.48,139.7
INSTRUCTION_A3  (via drill 0.35)
  Top 0.152: INSTRUCTION_MEMORY_0.7 21.59,144.78 24.13,144.78 26.67,142.24 INSTRUCTION_MEMORY_1.7 | v62.23,167 61.59,167.64 INSTRUCTIONS_EXTENSION.4 51.44,167.64 50.16,166.37 41.91,166.37 39.37,168.91 25.4,168.91 25.4,170.18 | INSTRUCTION_MEMORY_2.7 26.67,180.34 25.4,179.07 25.4,170.18 | v19.68,170.81 20.32,170.18 25.4,170.18
  Bottom 0.152: INSTRUC_REGISTER_LOWER.3 62.23,134.62 v62.23,167 | v19.68,170.81 INSTRUCTION_MEMORY_0.7
INSTRUCTION_A4  (via drill 0.35)
  Top 0.152: INSTRUC_REGISTER_UPPER.6 58.42,148.59 v55.88,146.05 | INSTRUCTION_MEMORY_1.6 25.4,147.32 21.59,147.32 INSTRUCTION_MEMORY_0.6 | v10.16,165.1 17.14,172.09 | 17.14,172.09 INSTRUCTION_MEMORY_2.6 | INSTRUCTIONS_EXTENSION.5 50.8,163.83 31.75,163.83 29.21,166.37 25.4,166.37 24.13,167.64 21.59,167.64 17.14,172.09
  Bottom 0.152: v55.88,146.05 55.88,160.66 52.07,164.47 INSTRUCTIONS_EXTENSION.5 | v10.16,165.1 10.16,162.56 8.89,161.29 INSTRUCTION_MEMORY_0.6
INSTRUCTION_A5  (via drill 0.35)